# Altium schematic sheet 1_P1.schdoc
size 518 x 391 mm; Symbol: Drawing-Symbol_A4; Device: Drawing-Symbol_A4; @Project Name: Twyst pcb; @Page Count: 1; @Update Date: 2025-10-17; @Create Date: 2025-10-15; @Schematic Name: Schematic1; @Page No: 1; @Page Name: P1; Company: EasyEDA.com; Version: V1.0; Page Size: A4; @Create Time: 16:16:22; @Update Time: 01:20:55; Width: 2000; Height: 1500; Region Start: 1; X Region Count: 6; Y Region Count: 4; Blade Width: 10; Title Block Position: 3; @Board Name: Board1
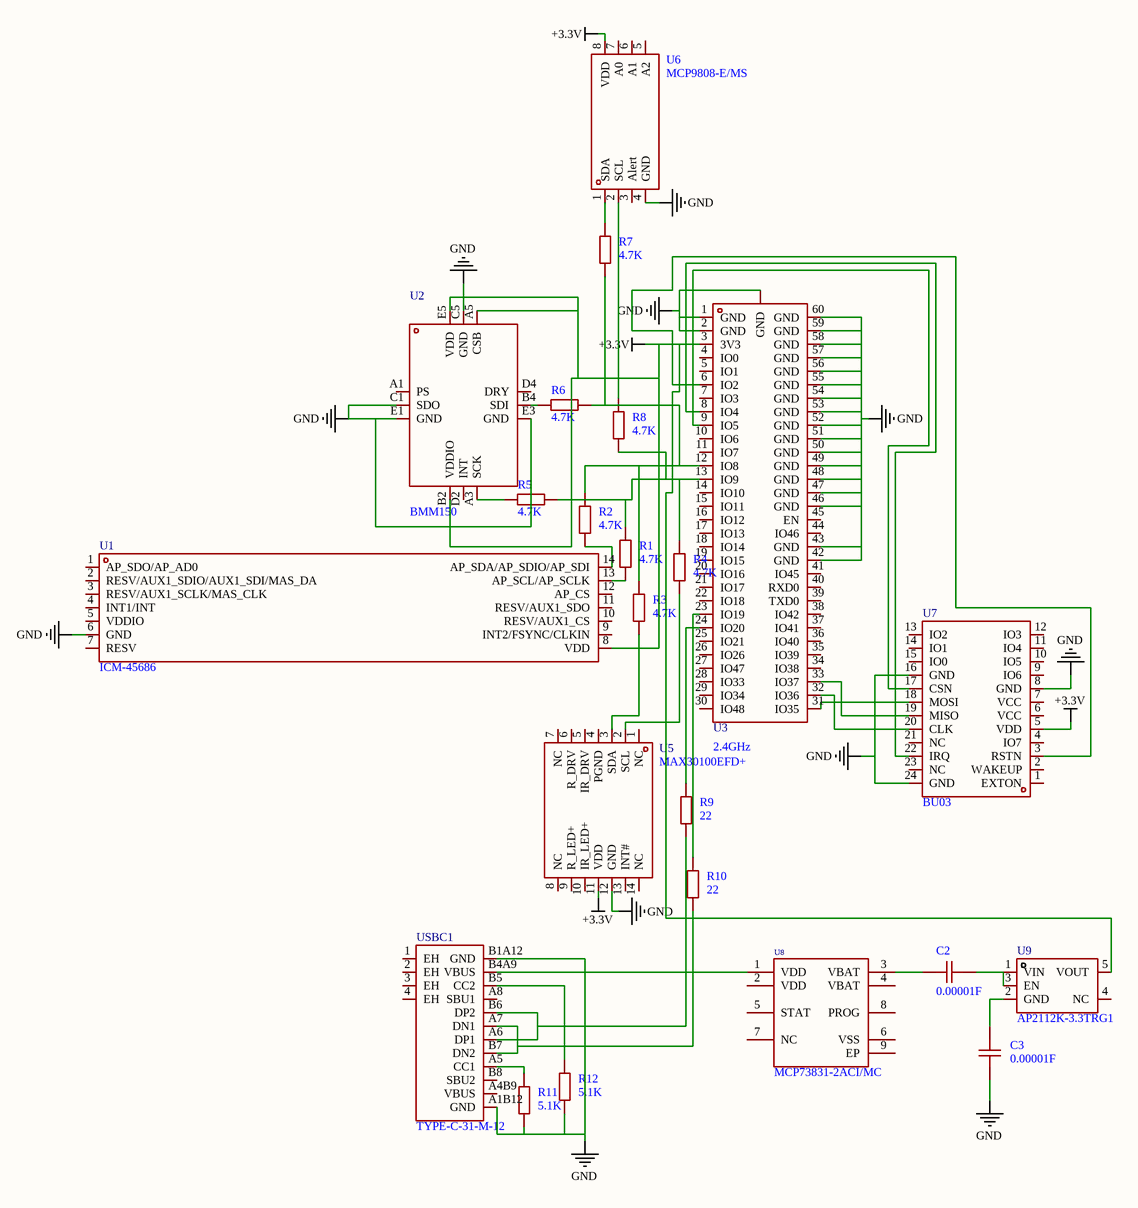
[diagram p0: 1_P1.schdoc]

## Parts
C2  0.00001F  [C0603]
C3  0.00001F  [C0603]
R1  4.7K  [R0603]
R2  4.7K  [R0603]
R3  4.7K  [R0603]
R4  4.7K  [R0603]
R5  4.7K  [R0603]
R6  4.7K  [R0603]
R7  4.7K  [R0603]
R8  4.7K  [R0603]
R9  22  [R0603]
R10  22  [R0603]
R11  5.1K  [R0603]
R12  5.1K  [R0603]
U1  ICM-45686  [LGA-14_L3.0-W2.5-P0.50-TL]
U2  BMM150  [WLCSP-12_L1.6-W1.6_BMM150]
U3  2.4GHz  [BULETM-SMD_ESP32-S3-MINI-1-N8]
U5  MAX30100EFD+  [SENSOR-SMD_MAX30100EFD]
U6  MCP9808-E/MS  [MSOP-8_L3.0-W3.0-P0.65-LS4.9-BL]
U7  BU03  [WIRELM-SMD_BU03]
U8  MCP73831-2ACI/MC  [TDFN-8_L3.0-W2.0-P0.50-BL-EP1.6]
U9  AP2112K-3.3TRG1  [SOT-23-5_L2.9-W1.6-P0.95-LS2.8-BR]
USBC1  TYPE-C-31-M-12  [USB-C_SMD-TYPE-C-31-M-12_1]

## Nets
+3.3V: U1.8(VDD) U2.A5(CSB) U2.B2(VDDIO) U2.E5(VDD) U3.3(3V3) U5.11(VDD) U6.8(VDD) U7.5(VDD) U9.5(VOUT)
GND: C3.2 R11.1 R12.1 U1.6(GND) U2.C1(SDO) U2.C5(GND) U2.E1(GND) U2.E3(GND) U3.1(GND) U3.2(GND) U3.42(GND) U3.43(GND) U3.46(GND) U3.47(GND) U3.48(GND) U3.49(GND) U3.50(GND) U3.51(GND) U3.52(GND) U3.53(GND) U3.54(GND) U3.55(GND) U3.56(GND) U3.57(GND) U3.58(GND) U3.59(GND) U3.60(GND) U3.GND U5.12(GND) U6.4(GND) U7.8(GND) U7.16(GND) U7.24(GND) USBC1.A1B12(GND) USBC1.B1A12(GND)
NetC2_1: C2.1 U9.1(VIN) U9.3(EN)
NetC2_2: C2.2 U8.3(VBAT)
NetC3_1: C3.1 U9.2(GND)
NetR1_1: R1.1 U1.13(AP_SCL/AP_SCLK)
NetR1_2: R1.2 R4.2 R5.1 R8.2 U3.13(IO9)
NetR2_1: R2.1 U1.14(AP_SDA/AP_SDIO/AP_SDI)
NetR2_2: R2.2 R3.2 R6.1 R7.2 U3.12(IO8)
NetR3_1: R3.1 U5.3(SDA)
NetR4_1: R4.1 U5.2(SCL)
NetR5_2: R5.2 U2.A3(SCK)
NetR6_2: R6.2 U2.B4(SDI)
NetR7_1: R7.1 U6.1(SDA)
NetR8_1: R8.1 U6.2(SCL)
NetR9_1: R9.1 USBC1.A6(DP1) USBC1.B6(DP2)
NetR9_2: R9.2 U3.24(IO20)
NetR10_1: R10.1 USBC1.A7(DN1) USBC1.B7(DN2)
NetR10_2: R10.2 U3.23(IO19)
NetR11_2: R11.2 USBC1.A5(CC1)
NetR12_2: R12.2 USBC1.B5(CC2)
NetU3_6: U3.6(IO2) U7.3(RSTN)
NetU3_8: U3.8(IO4) U7.22(IRQ)
NetU3_9: U3.9(IO5) U7.17(CSN)
NetU3_31: U3.31(IO35) U7.18(MOSI)
NetU3_32: U3.32(IO36) U7.20(CLK)
NetU3_33: U3.33(IO37) U7.19(MISO)
NetU8_1: U8.1(VDD) USBC1.B4A9(VBUS)

Not connected (* = marked no-connect by the designer): U1 1(AP_SDO/AP_AD0) 2(RESV/AUX1_SDIO/AUX1_SDI/MAS_DA) 3(RESV/AUX1_SCLK/MAS_CLK) 4(INT1/INT) 5(VDDIO) 7(RESV) 9(INT2/FSYNC/CLKIN) 10(RESV/AUX1_CS) 11(RESV/AUX1_SDO) 12(AP_CS); U2 A1(PS) D2(INT) D4(DRY); U3 4(IO0) 5(IO1) 7(IO3) 10(IO6) 11(IO7) 14(IO10) 15(IO11) 16(IO12) 17(IO13) 18(IO14) 19(IO15) 20(IO16) 21(IO17) 22(IO18) 25(IO21) 26(IO26) 27(IO47) 28(IO33) 29(IO34) 30(IO48) 34(IO38) 35(IO39) 36(IO40) 37(IO41) 38(IO42) 39(TXD0) 40(RXD0) 41(IO45) 44(IO46) 45(EN); U5 1(NC) 4(PGND) 5(IR_DRV) 6(R_DRV) 7(NC) 8(NC) 9(R_LED+) 10(IR_LED+) 13(INT#) 14(NC); U6 3(Alert) 5(A2) 6(A1) 7(A0); U7 1(EXTON) 2(WAKEUP) 4(IO7) 6(VCC) 7(VCC) 9(IO6) 10(IO5) 11(IO4) 12(IO3) 13(IO2) 14(IO1) 15(IO0) 21(NC) 23(NC); U8 2(VDD) 4(VBAT) 5(STAT) 6(VSS) 7(NC) 8(PROG) 9(EP); U9 4(NC); USBC1 1(EH) 2(EH) 3(EH) 4(EH) A4B9(VBUS) A8(SBU1) B8(SBU2)

## Notes on the sheet
- 1
- 2
- 3
- 4
- 5
- 6
- A
- B
- C
- D
- Schematic
- Schematic1
- Create at
- Update at
- 2025-10-15
- 2025-10-17
- Board
- Drawn
- Board1
- Page
- P1
- Reviewed
- Version
- Size
- Twyst pcb
- Page  1  Total  1
- V1.0
- A4
- EasyEDA.com

## Library data of the parts
C2 C3 = CAP_0603: Symbol: CAP; Convert to PCB: yes; Device: CAP_0603; Add into BOM: yes; Supplier Footprint: 0603; Value: 0.00001F
R1-R12 = Res_0603: Symbol: Res; Convert to PCB: yes; Device: Res_0603; Add into BOM: yes; Supplier Footprint: 0603
  R1-R8: Value: 4.7K
  R9 R10: Value: 22
  R11 R12: Value: 5.1K
U1 = ICM-45686: Manufacturer: TDK InvenSense(应美盛); Add into BOM: yes; Symbol: ICM-45686; Device: ICM-45686; LCSC Part Name: ICM-45686; Supplier Part: C22459454; Manufacturer Part: ICM-45686; Supplier Footprint: LGA-14(3x2.5); JLCPCB Part Class: Extended Part; Datasheet: https://item.szlcsc.com/datasheet/ICM-45686/24135842.html; Supplier: LCSC; Convert to PCB: yes
U2 = BMM150: Manufacturer: Bosch(博世); Add into BOM: yes; Symbol: BMM150; Device: BMM150; LCSC Part Name: 三轴地磁式传感器 停产; Supplier Part: C171681; Manufacturer Part: BMM150; Supplier Footprint: WLCSP-12(1.6x1.6); JLCPCB Part Class: Extended Part; Datasheet: https://atta.szlcsc.com/upload/public/pdf/source/20180327/C171681_AC95244FE88EF9D8F701E0ABF38F9AC1.pdf; Supplier: LCSC; Convert to PCB: yes
U3 = ESP32-S3-MINI-1-N8: Manufacturer: ESPRESSIF(乐鑫); Add into BOM: yes; Core Processor: ESP32-S3FN8 Chip; Support Interface: I2C；GPIO；SPI；PWM；ADC；UART；USB；I2S; Output Power: 20.5dBm; Symbol: ESP32-S3-MINI-1-N8; Device: ESP32-S3-MINI-1-N8; LCSC Part Name: ESP32-S3-MINI-1-N8; Supplier Part: C2913206; Manufacturer Part: ESP32-S3-MINI-1-N8; Supplier Footprint: SMD; JLCPCB Part Class: Extended Part; Datasheet: https://atta.szlcsc.com/upload/public/pdf/source/20220425/7F117D7A09F85946280540FD9EFDF9F3.pdf; Supplier: LCSC; Convert to PCB: yes; Wireless Standard: -; Value: 2.4GHz; Antenna Type: -; Operating Voltage: -; Receive  Current: -; Send  Current: -; Sensitivity: -; Operating Temperature: -
U5 = MAX30100EFD+: Manufacturer: ADI(亚德诺); Add into BOM: yes; Interface: I2C; Symbol: MAX30100EFD+; Device: MAX30100EFD+; LCSC Part Name: I2C接口的脉搏血氧计和心率传感器IC; Supplier Part: C92512; Manufacturer Part: MAX30100EFD+; Supplier Footprint: SMD-14P,2.8x5.6mm; JLCPCB Part Class: Extended Part; Datasheet: https://atta.szlcsc.com/upload/public/pdf/source/20170105/1483610796774.pdf; Supplier: LCSC; Convert to PCB: yes
U6 = MCP9808-E/MS: Manufacturer: MICROCHIP(美国微芯); Add into BOM: yes; Voltage - Supply: 2.7V~5.5V; Symbol: MCP9808-E/MS; Device: MCP9808-E/MS; LCSC Part Name: MCP9808-E/MS; Supplier Part: C94847; Manufacturer Part: MCP9808-E/MS; Supplier Footprint: MSOP-8; JLCPCB Part Class: Extended Part; Datasheet: https://item.szlcsc.com/datasheet/MCP9808-E%252FMS/96047.html; Supplier: LCSC; Convert to PCB: yes
U7 = BU03: Manufacturer: Ai-Thinker(安信可); Add into BOM: yes; Symbol: BU03; Device: BU03; LCSC Part Name: BU03; Supplier Part: C42419011; Manufacturer Part: BU03; Supplier Footprint: SMD,23x13mm; JLCPCB Part Class: Extended Part; Datasheet: https://atta.szlcsc.com/upload/public/pdf/source/20241223/DD33CB8A3691EFFD799F272BF7523F1A.pdf; Supplier: LCSC; Convert to PCB: yes
U8 = MCP73831-2ACI/MC: Manufacturer: MICROCHIP(美国微芯); Add into BOM: yes; Voltage - Supply: 3.75V~6V; Charging Saturation Voltage: 4.2V; Type of Battery: Lithium-ion/Polymer; Number of Cells: 1; Symbol: MCP73831-2ACI/MC; Device: MCP73831-2ACI/MC; Supplier: LCSC; Manufacturer Part: MCP73831-2ACI/MC; Supplier Part: C150772; JLCPCB Part Class: Extended Part; LCSC Part Name: MCP73831-2ACI/MC; Supplier Footprint: TDFN-8-EP(2x3); Datasheet: https://item.szlcsc.com/datasheet/MCP73831-2ACI%252FMC/162112.html; Convert to PCB: yes; The Chip Type: -; Charge Current - Max: -; Operating Temperature: -40℃~+85℃
U9 = AP2112K-3.3TRG1_C23380830: Manufacturer: TECH PUBLIC(台舟); Add into BOM: yes; Output Type: Fixed; Voltage - Supply: 5.5V; Output Voltage: 3.3V; Output Current: 600mA; Power Supply Rejection Ratio (PSRR): 75dB@(1kHz); Voltage Dropout: 320mV@(600mA); standby current: 10uA; Output Configuration: Positive; Symbol: AP2112K-3.3TRG1_C23380830; Device: AP2112K-3.3TRG1_C23380830; LCSC Part Name: 集成电路; Supplier Part: C23380830; Manufacturer Part: AP2112K-3.3TRG1; Supplier Footprint: SOT-23-5; JLCPCB Part Class: Extended Part; Datasheet: https://item.szlcsc.com/datasheet/AP2112K-3.3TRG1/25111500.html; Supplier: LCSC; Convert to PCB: yes; Features: Over Temperature Protection; Operating Temperature: -40℃~+85℃@(Ta)
USBC1 = TYPE-C-31-M-12: Manufacturer: 韩国韩荣; Add into BOM: yes; Connector Type: Type-C; Gender: Female; Number of Contacts: 16P; Number of Ports: 1; Current Rating-Power: 5A; Symbol: TYPE-C-31-M-12; Device: TYPE-C-31-M-12; LCSC Part Name: Type-C 母; Supplier Part: C165948; Manufacturer Part: TYPE-C-31-M-12; Supplier Footprint: SMD; JLCPCB Part Class: Extended Part; Datasheet: https://item.szlcsc.com/datasheet/TYPE-C-31-M-12/177331.html; Supplier: LCSC; Convert to PCB: yes; Protocol Standard: -; Mounting Type: -; Operating Temperature: -